# Altium schematic sheet [2] IO Expander.SchDoc
size A4; DocumentNumber: 2; SheetNumber: 2; SheetTotal: 5
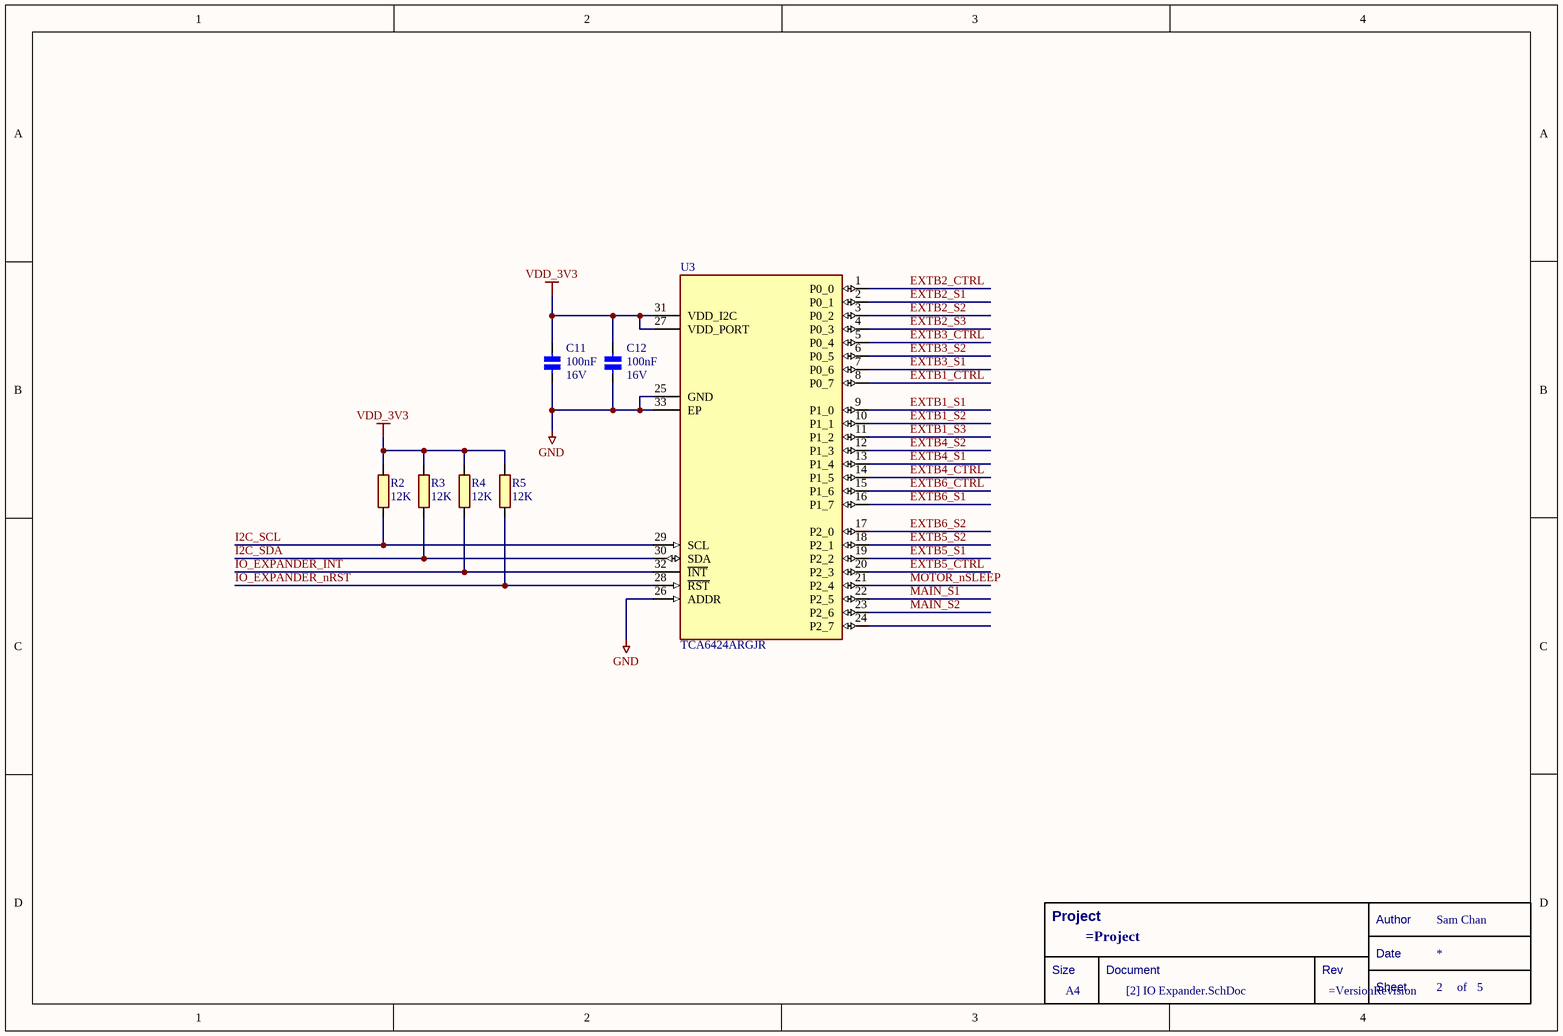
[diagram p0: [2] IO Expander.SchDoc]

## Parts
*  Title Block  (value not drawn)  (graphical)
C11  Voltage - Rated: 16V  [CAPC0402X05N]  (hidden comment: 100nF)
C12  Voltage - Rated: 16V  [CAPC0402X05N]  (hidden comment: 100nF)
R2  12K  [RESC0402X04N]
R3  12K  [RESC0402X04N]
R4  12K  [RESC0402X04N]
R5  12K  [RESC0402X04N]
U3  TCA6424ARGJR  [TCA6424ARGJR]

## Nets
GND: C11.2 C12.2 U3.25(GND) U3.26(ADDR) U3.33(EP)
VDD_3V3: C11.1 C12.1 R2.2 R3.2 R4.2 R5.2 U3.27(VDD_PORT) U3.31(VDD_I2C)
EXTB1_CTRL: U3.8(P0_7)
EXTB1_S1: U3.9(P1_0)
EXTB1_S2: U3.10(P1_1)
EXTB1_S3: U3.11(P1_2)
EXTB2_CTRL: U3.1(P0_0)
EXTB2_S1: U3.2(P0_1)
EXTB2_S2: U3.3(P0_2)
EXTB2_S3: U3.4(P0_3)
EXTB3_CTRL: U3.5(P0_4)
EXTB3_S1: U3.7(P0_6)
EXTB3_S2: U3.6(P0_5)
EXTB4_CTRL: U3.14(P1_5)
EXTB4_S1: U3.13(P1_4)
EXTB4_S2: U3.12(P1_3)
EXTB5_CTRL: U3.20(P2_3)
EXTB5_S1: U3.19(P2_2)
EXTB5_S2: U3.18(P2_1)
EXTB6_CTRL: U3.15(P1_6)
EXTB6_S1: U3.16(P1_7)
EXTB6_S2: U3.17(P2_0)
I2C_SCL: R2.1 U3.29(SCL)
I2C_SDA: R3.1 U3.30(SDA)
IO_EXPANDER_INT: R4.1 U3.32(~{INT})
IO_EXPANDER_nRST: R5.1 U3.28(~{RST})
MAIN_S1: U3.22(P2_5)
MAIN_S2: U3.23(P2_6)
MOTOR_nSLEEP: U3.21(P2_4)

Not connected (* = marked no-connect by the designer): U3 24(P2_7)

## Notes on the sheet
- (in symbol Title Block) Project; Author; Sam Chan; Date; Size; Document; Rev; A4; Sheet; of

## Library data of the parts
* = Title Block: Standard Title Block
C11 C12 = CER 100NF 16V: CAP CER 0.1UF 16V X7R 0402; Manufacturer: Samsung Electro-Mechanics; Manufacturer Part Number: CL05B104KO5NNNC; Category: Capacitors; Supplier 1: LCSC; Supplier Part Number 1: C1525; Package / Case: 0402; Capacitance: 100nF
R2-R5 = RES 12K: RES SMD 12K OHM 1% 1/16W 0402; Manufacturer: YAGEO; Manufacturer Part Number: RC0402FR-0712KL; Category: Resistors; Package / Case: 0402; Supplier 1: LCSC; Supplier Part Number 1: C114760; Resistance: 12K
U3 = TCA6424ARGJR: IC I/O EXPANDER I2C 24B 32UQFN; Manufacturer: Texas Instruments; Categories: I/O Expanders; Case: 32-UFQFN Exposed Pad; Manufacturer Part Number: TCA6424ARGJR; Supplier 1: LCSC; Supplier Part Number 1: C80692